# Altium schematic sheet Sheet_1.schdoc
size 308 x 204 mm
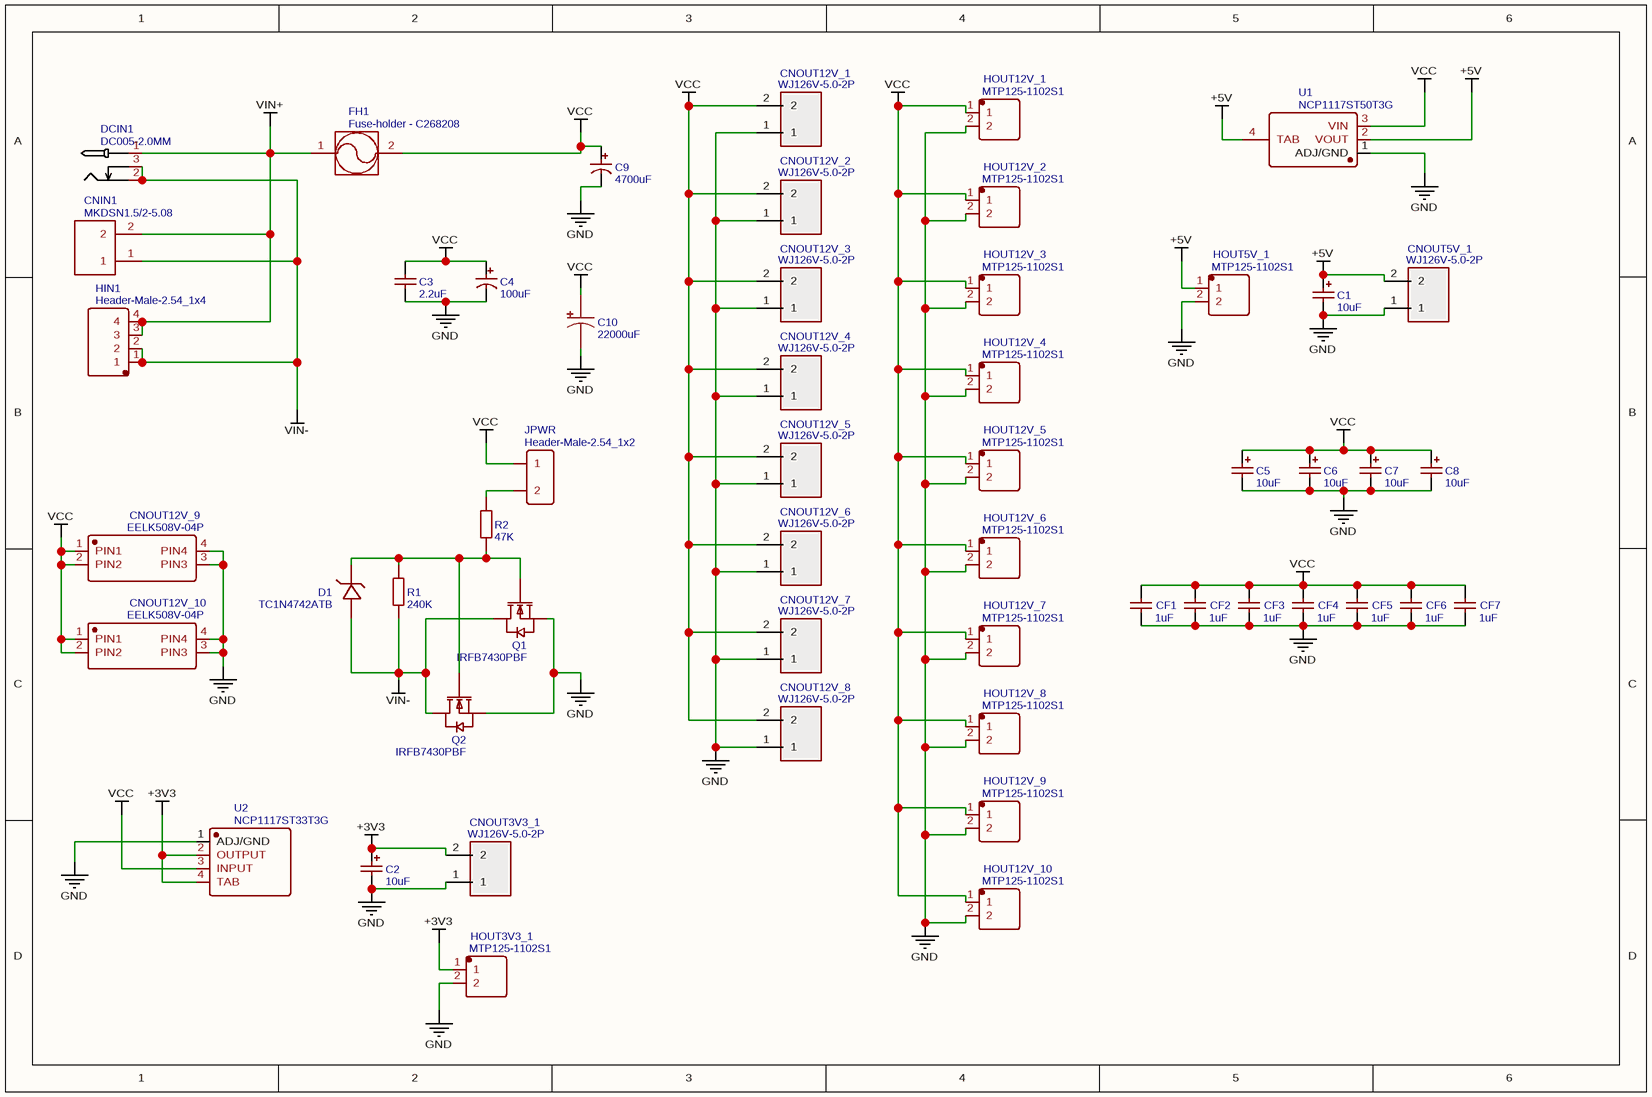
[diagram p0: Sheet_1.schdoc]

## Parts
C1  10uF  [CAP-TAN-S2.5]
C2  10uF  [CAP-TAN-S2.5]
C3  2.2uF  [CAP-0.2]
C4  100uF  [CAP-TH_BD6.3-P2.50-D1.0-FD]
C5  10uF  [CAP-TAN-S2.5]
C6  10uF  [CAP-TAN-S2.5]
C7  10uF  [CAP-TAN-S2.5]
C8  10uF  [CAP-TAN-S2.5]
C9  4700uF  [CAP-TH_BD16.0-P7.50-D1.2-FD]
C10  22000uF  [CAP-TH_BD35.0-P10.00-D2.3-FD]
CF1  1uF  [CAP-0.2]
CF2  1uF  [CAP-0.2]
CF3  1uF  [CAP-0.2]
CF4  1uF  [CAP-0.2]
CF5  1uF  [CAP-0.2]
CF6  1uF  [CAP-0.2]
CF7  1uF  [CAP-0.2]
CNIN1  MKDSN1.5/2-5.08  [MKDSN1.5/2-5.08]
CNOUT3V3_1  WJ126V-5.0-2P  [WJ126V-5.0-2P]
CNOUT5V_1  WJ126V-5.0-2P  [WJ126V-5.0-2P]
CNOUT12V_1  WJ126V-5.0-2P  [WJ126V-5.0-2P]
CNOUT12V_2  WJ126V-5.0-2P  [WJ126V-5.0-2P]
CNOUT12V_3  WJ126V-5.0-2P  [WJ126V-5.0-2P]
CNOUT12V_4  WJ126V-5.0-2P  [WJ126V-5.0-2P]
CNOUT12V_5  WJ126V-5.0-2P  [WJ126V-5.0-2P]
CNOUT12V_6  WJ126V-5.0-2P  [WJ126V-5.0-2P]
CNOUT12V_7  WJ126V-5.0-2P  [WJ126V-5.0-2P]
CNOUT12V_8  WJ126V-5.0-2P  [WJ126V-5.0-2P]
CNOUT12V_9  EELK508V-04P  [EELK508V-04P]
CNOUT12V_10  EELK508V-04P  [EELK508V-04P]
D1  TC1N4742ATB  [DO-41_BD2.4-L4.7-P8.70-D0.9-FD]
DCIN1  DC005-2.0MM  [DC-5020]
FH1  Fuse-holder - C268208  [FUSE-HOLDER- C268208]
HIN1  Header-Male-2.54_1x4  [DIP-1X4P-2.54MM-M]
HOUT3V3_1  MTP125-1102S1  [HDR-TH_2P-P2.54-V_A2541HWV-2P]
HOUT5V_1  MTP125-1102S1  [HDR-TH_2P-P2.54-V_A2541HWV-2P]
HOUT12V_1  MTP125-1102S1  [HDR-TH_2P-P2.54-V_A2541HWV-2P]
HOUT12V_2  MTP125-1102S1  [HDR-TH_2P-P2.54-V_A2541HWV-2P]
HOUT12V_3  MTP125-1102S1  [HDR-TH_2P-P2.54-V_A2541HWV-2P]
HOUT12V_4  MTP125-1102S1  [HDR-TH_2P-P2.54-V_A2541HWV-2P]
HOUT12V_5  MTP125-1102S1  [HDR-TH_2P-P2.54-V_A2541HWV-2P]
HOUT12V_6  MTP125-1102S1  [HDR-TH_2P-P2.54-V_A2541HWV-2P]
HOUT12V_7  MTP125-1102S1  [HDR-TH_2P-P2.54-V_A2541HWV-2P]
HOUT12V_8  MTP125-1102S1  [HDR-TH_2P-P2.54-V_A2541HWV-2P]
HOUT12V_9  MTP125-1102S1  [HDR-TH_2P-P2.54-V_A2541HWV-2P]
HOUT12V_10  MTP125-1102S1  [HDR-TH_2P-P2.54-V_A2541HWV-2P]
JPWR  Header-Male-2.54_1x2  [HDR-2X1/2.54]
Q1  IRFB7430PBF  [TO-220-3_L10.0-W4.5-P2.54-L]
Q2  IRFB7430PBF  [TO-220-3_L10.0-W4.5-P2.54-L]
R1  240K  [RES-TH_BD2.3-L6.5-P10.50-D0.5]
R2  47K  [RES-TH_BD2.2-L6.5-P10.50-D0.6]
U1  NCP1117ST50T3G  [SOT-223_L6.5-W3.5-P2.30-LS7.0-BR]
U2  NCP1117ST33T3G  [SOT-223-3_L6.5-W3.4-P2.30-LS7.0-BR]

## Nets
+3V3: C2.1 CNOUT3V3_1.2 HOUT3V3_1.1 U2.2(OUTPUT) U2.4(TAB)
+5V: C1.1 CNOUT5V_1.2 HOUT5V_1.1 U1.2(VOUT) U1.4(TAB)
GND: C1.2 C2.2 C3.1 C4.2 C5.2 C6.2 C7.2 C8.2 C9.2 C10.2 CF1.1 CF2.1 CF3.1 CF4.1 CF5.1 CF6.1 CF7.1 CNOUT3V3_1.1 CNOUT5V_1.1 CNOUT12V_1.1 CNOUT12V_2.1 CNOUT12V_3.1 CNOUT12V_4.1 CNOUT12V_5.1 CNOUT12V_6.1 CNOUT12V_7.1 CNOUT12V_8.1 CNOUT12V_9.3(PIN3) CNOUT12V_9.4(PIN4) CNOUT12V_10.3(PIN3) CNOUT12V_10.4(PIN4) HOUT3V3_1.2 HOUT5V_1.2 HOUT12V_1.2 HOUT12V_2.2 HOUT12V_3.2 HOUT12V_4.2 HOUT12V_5.2 HOUT12V_6.2 HOUT12V_7.2 HOUT12V_8.2 HOUT12V_9.2 HOUT12V_10.2 Q1.3(S) Q2.3(S) U1.1(ADJ/GND) U2.1(ADJ/GND)
VCC: C3.2 C4.1 C5.1 C6.1 C7.1 C8.1 C9.1 C10.1 CF1.2 CF2.2 CF3.2 CF4.2 CF5.2 CF6.2 CF7.2 CNOUT12V_1.2 CNOUT12V_2.2 CNOUT12V_3.2 CNOUT12V_4.2 CNOUT12V_5.2 CNOUT12V_6.2 CNOUT12V_7.2 CNOUT12V_8.2 CNOUT12V_9.1(PIN1) CNOUT12V_9.2(PIN2) CNOUT12V_10.1(PIN1) CNOUT12V_10.2(PIN2) FH1.2 HOUT12V_1.1 HOUT12V_2.1 HOUT12V_3.1 HOUT12V_4.1 HOUT12V_5.1 HOUT12V_6.1 HOUT12V_7.1 HOUT12V_8.1 HOUT12V_9.1 HOUT12V_10.1 JPWR.1 U1.3(VIN) U2.3(INPUT)
VIN+: CNIN1.2 DCIN1.1 FH1.1 HIN1.3 HIN1.4
VIN-: CNIN1.1 D1.1(A) DCIN1.2 DCIN1.3 HIN1.1 HIN1.2 Q1.2(D) Q2.2(D) R1.1
NetD1_2: D1.2(K) Q1.1(G) Q2.1(G) R1.2 R2.1
NetJPWR_2: JPWR.2 R2.2

## Library data of the parts
C1 C2 C5-C8 = 10uF: BOM_Manufacturer: AVX; BOM_Manufacturer Part: TAP106K025SCS; nameAlias: Capacitance; BOM_Supplier: LCSC; BOM_Supplier Part: C28244; spicePre: C; spiceSymbolName: TAP106K025SCS
C3 = 2.2uF: BOM_Manufacturer: Dersonic; BOM_Manufacturer Part: CD1H225KC9BER1F000; nameAlias: Capacitance; Contributor: LCSC; BOM_Supplier: LCSC; BOM_Supplier Part: C263192; spicePre: C; spiceSymbolName: CD1H225KC9BER1F000
C4 = 100uF: BOM_Manufacturer: ValuePro; BOM_Manufacturer Part: 100uF 50V 6.3*12Black high frequency; nameAlias: Capacitance; BOM_Supplier: LCSC; BOM_Supplier Part: C47891; spicePre: C; spiceSymbolName: 100uF 50V 6.3*12Black high frequency
C9 = 4700uF: BOM_Manufacturer: ValuePro; BOM_Manufacturer Part: 4700uF 25V 16*25V; nameAlias: Capacitance; BOM_Supplier: LCSC; BOM_Supplier Part: C45070; spicePre: C; spiceSymbolName: 4700uF 25V 16*25V
C10 = 22000uF: BOM_Manufacturer: Xunda; BOM_Manufacturer Part: PP2291IMT452RB; nameAlias: Capacitance; Contributor: LCSC; BOM_Supplier: LCSC; BOM_Supplier Part: C406796; spicePre: C; spiceSymbolName: PP2291IMT452RB
CF1-CF7 = 1uF: BOM_Manufacturer: Dersonic; BOM_Manufacturer Part: CD1H105MC9BEF4E000; nameAlias: Capacitance; Contributor: LCSC; BOM_Supplier: LCSC; BOM_Supplier Part: C263189; spicePre: C; spiceSymbolName: CD1H105MC9BEF4E000
CNIN1 = MKDSN1.5/2-5.08: BOM_Manufacturer: Phoenix Contact; BOM_Supplier: LCSC; BOM_Manufacturer Part: MKDSN1.5/2-5.08; BOM_Supplier Part: C91153; spicePre: C
CNOUT3V3_1 CNOUT5V_1 CNOUT12V_1-CNOUT12V_8 = WJ126V-5.0-2P: BOM_Manufacturer: ReliaPro; BOM_Supplier: LCSC; BOM_Manufacturer Part: WJ126V-5.0-2P; image: //image.lceda.cn/szlcsc/C8404.jpg; BOM_Supplier Part: C8404; spicePre: P; spiceSymbolName: WJ126V-5.0-2P
CNOUT12V_9 CNOUT12V_10 = EELK508V-04P: BOM_Manufacturer: Dinkle; Contributor: LCSC; BOM_Supplier: LCSC; BOM_Manufacturer Part: EELK508V-04P; BOM_Supplier Part: C99398; spicePre: C; spiceSymbolName: EELK508V-04P
D1 = TC1N4742ATB: BOM_Manufacturer: Tak Cheong; Contributor: LCSC; BOM_Supplier: LCSC; BOM_Supplier Part: C261214; BOM_Manufacturer Part: TC1N4742ATB; spicePre: D; spiceSymbolName: TC1N4742ATB
DCIN1 = DC005-2.0MM: BOM_Manufacturer: SOFNG; BOM_Supplier: LCSC; BOM_Manufacturer Part: DC005-2.0MM; BOM_Supplier Part: C111567; spicePre: D
FH1 = Fuse-holder - C268208: Contributor: AGRATX; BOM_Supplier Part: C268208; BOM_Supplier: LCSC; spicePre: U
HIN1 = Header-Male-2.54_1x4: BOM_Manufacturer: Ckmtw; BOM_Manufacturer Part: 210S-1*4P L=11.6MMGold-plated black; Contributor: LCSC; BOM_Supplier: LCSC; BOM_Supplier Part: C124378; spicePre: H
HOUT3V3_1 HOUT5V_1 HOUT12V_1-HOUT12V_10 = MTP125-1102S1: BOM_Manufacturer: MINTRON; Contributor: LCSC; BOM_Supplier: LCSC; BOM_Supplier Part: C358684; BOM_Manufacturer Part: MTP125-1102S1; spicePre: U; spiceSymbolName: MTP125-1102S1
JPWR = Header-Male-2.54_1x2: BOM_Manufacturer: TE Connectivity; BOM_Manufacturer Part: 826629-2; BOM_Supplier: LCSC; image: //image.lceda.cn/szlcsc/C86471.jpg; BOM_Supplier Part: C86471; spicePre: H; spiceSymbolName: Header-Male-2.54_1x2
Q1 Q2 = IRFB7430PBF: BOM_Manufacturer: International Rectifier; Contributor: LCSC; BOM_Supplier: LCSC; BOM_Supplier Part: C46358; BOM_Manufacturer Part: IRFB7430PBF; spicePre: Q; spiceSymbolName: IRFB7430PBF
R1 = 240K: BOM_Manufacturer: Chian Chia Elec; nameAlias: Resistance (Ohms); Contributor: LCSC; BOM_Supplier: LCSC; BOM_Supplier Part: C119375; BOM_Manufacturer Part: -; spicePre: R; spiceSymbolName: MF1/4W-240KΩ±1% T52
R2 = 47K: BOM_Manufacturer: Chian Chia Elec; nameAlias: Resistance (Ohms); Contributor: LCSC; BOM_Supplier: LCSC; BOM_Supplier Part: C119362; BOM_Manufacturer Part: -; spicePre: R; spiceSymbolName: MF1/4W-47KΩ±1% T52
U1 = NCP1117ST50T3G: BOM_Manufacturer: ON; SMT Type: Extend; timeStamp: 1466353290; BOM_Supplier: LCSC; BOM_Manufacturer Part: NCP1117ST50T3G; image: //image.lceda.cn/szlcsc/C17314.jpg; BOM_Supplier Part: C17314; BOM_LCSC Assembly: Yes; spicePre: U
U2 = NCP1117ST33T3G: BOM_Manufacturer: ON; SMT Type: Extend; timeStamp: 1466353290; BOM_Supplier: LCSC; BOM_Manufacturer Part: NCP1117ST33T3G; image: //image.lceda.cn/szlcsc/C26537.jpg; BOM_Supplier Part: C26537; BOM_LCSC Assembly: Yes; spicePre: U